# EAGLE design photon (EAGLE 7.1.0)

## Sheet 1 of 2
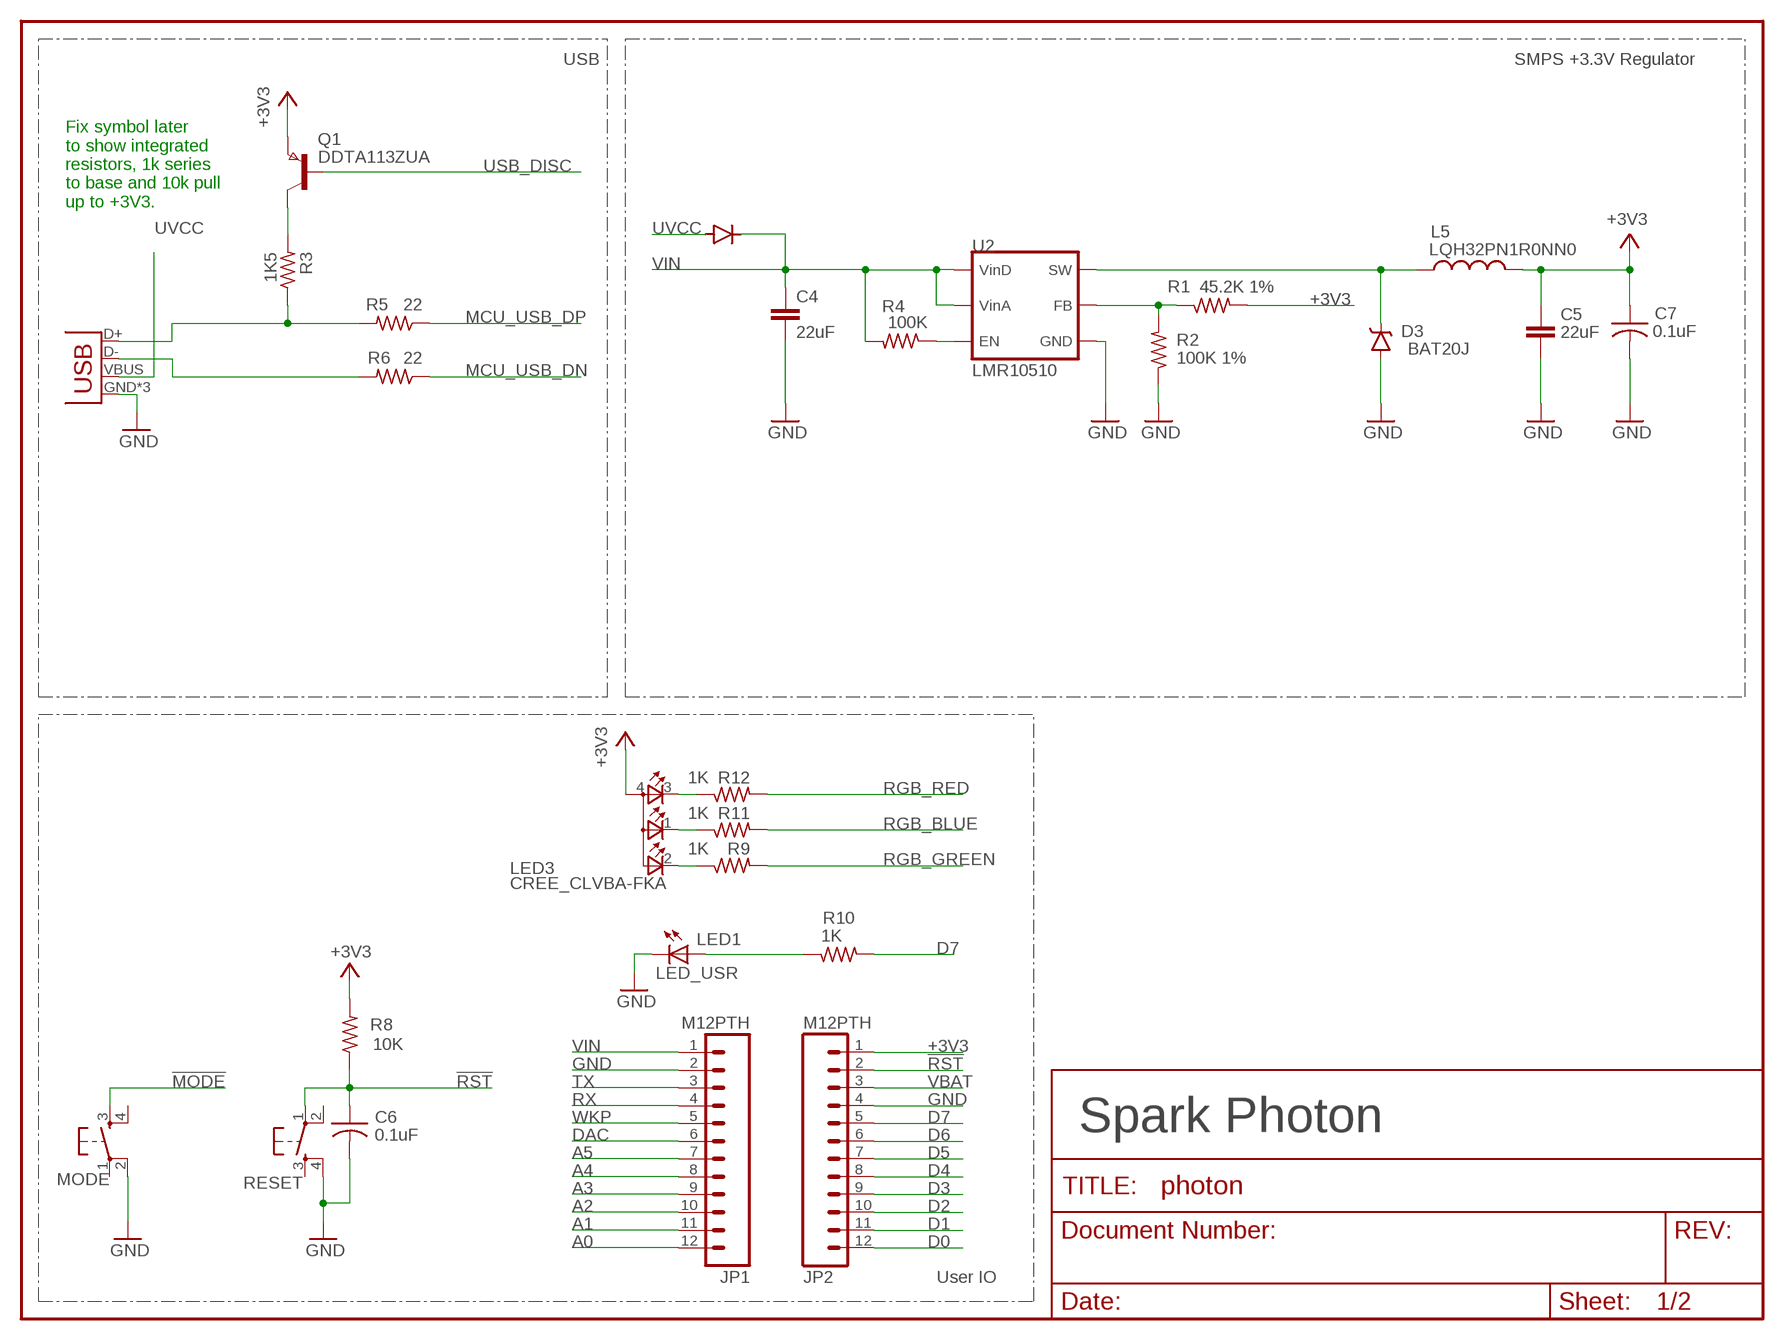
[diagram p0: schematic, sheet 1]

### Parts
C4  22uF  C-EUC0603  [C0603]
C5  22uF  C-EUC0603  [C0603]
C6  0.1uF  C-USC0402  [C0402]
C7  0.1uF  C-USC0402  [C0402]
D1  DIODE  [DIODE-DO-220AA(SMP)]
D3  BAT20J  DIODE-SCHOTTKY-BAT20J  [SOD-323]
JP1  M12PTH  [1X12-SMALL-PADS]
JP2  M12PTH  [1X12-SMALL-PADS]
L5  LQH32PN1R0NN0  INDUCTOR-SPARKFUN1210  [1210]
LED3  CREE_CLVBA-FKA  TOPLED-3CREE_CLVBA-FKA  [P-LCC-4-3]
LED_USR  LED0603  [LED-0603]
MODE  KMR211GLFS  TAC_SWITCHSMD  [TACTILE_SWITCH_SMD]
Q1  DDTA113ZUA  PNPSOT323  [SOT323]
R1  45.2K 1%  R-US_R0402  [R0402]
R2  100K 1%  R-US_R0402  [R0402]
R3  1K5  R-US_R0402  [R0402]
R4  100K  R-US_R0402  [R0402]
R5  22  R-US_R0402  [R0402]
R6  22  R-US_R0402  [R0402]
R8  10K  R-US_R0402  [R0402]
R9  1K  R-US_R0402  [R0402]
R10  1K  R-US_R0402  [R0402]
R11  1K  R-US_R0402  [R0402]
R12  1K  R-US_R0402  [R0402]
RESET  KMR211GLFS  TAC_SWITCHSMD  [TACTILE_SWITCH_SMD]
U2  LMR10510  [WSON-6-PAD]
X1  USB-MICROB  USBUSB-MICROB-SLOT-HOLE  [USB-MICROB-SLOT-HOLE]

### Nets
!MODE: MODE.3 ; also sheet 2
!RST: C6.1 JP2.2 R8.1 RESET.1 ; also sheet 2
+3V3: C5.1 C7.1 JP2.1 L5.2 LED3.4(A2) Q1.3(E) R1.2 R8.2
A0: JP1.12 ; also sheet 2
A1: JP1.11 ; also sheet 2
A2: JP1.10 ; also sheet 2
A3: JP1.9 ; also sheet 2
A4: JP1.8 ; also sheet 2
A5: JP1.7 ; also sheet 2
D0: JP2.12 ; also sheet 2
D1: JP2.11 ; also sheet 2
D2: JP2.10 ; also sheet 2
D3: JP2.9 ; also sheet 2
D4: JP2.8 ; also sheet 2
D5: JP2.7 ; also sheet 2
D6: JP2.6 ; also sheet 2
D7: JP2.5 R10.2
DAC: JP1.6 ; also sheet 2
EN: R4.1 U2.6(EN)
FB: R1.1 R2.2 U2.1(FB)
GND [vcc]: C4.2 C5.2 C6.2 C7.2 D3.A JP1.2 JP2.4 LED_USR.C MODE.2 R2.1 RESET.4 U2.2(GND) U2.PAD(GND) X1.GND X1.MT1(GND) X1.MT2(GND) ; also sheet 2
LED1: LED_USR.A R10.1
MCU_USB_DN: R6.1 ; also sheet 2
MCU_USB_DP: R5.1 ; also sheet 2
N$1: R3.1 R5.2 X1.D+
N$6: R6.2 X1.D-
N$9: Q1.1(C) R3.2
N$27: LED3.1(CBLUE) R11.1
N$29: LED3.2(CGREEN) R9.1
N$54: LED3.3(CRED) R12.1
RGB_BLUE: R11.2 ; also sheet 2
RGB_GREEN [vcc]: R9.2 ; also sheet 2
RGB_RED: R12.2 ; also sheet 2
RX: JP1.4 ; also sheet 2
SW: D3.C L5.1 U2.3(SW)
TX: JP1.3 ; also sheet 2
USB_DISC: Q1.2(B) ; also sheet 2
UVCC: D1.ANODE X1.VBUS
VBAT: JP2.3 ; also sheet 2
VIN [vcc]: C4.1 D1.CATHODE JP1.1 R4.2 U2.4(VIND) U2.5(VINA)
WKP: JP1.5 ; also sheet 2
Unconnected: MODE.1 MODE.4 RESET.2 RESET.3

### Notes on the sheet
- USB | SMPS +3.3V Regulator
- Fix symbol later 
  to show integrated 
  resistors, 1k series 
  to base and 10k pull 
  up to +3V3.
- Spark Photon
- User IO

## Sheet 2 of 2
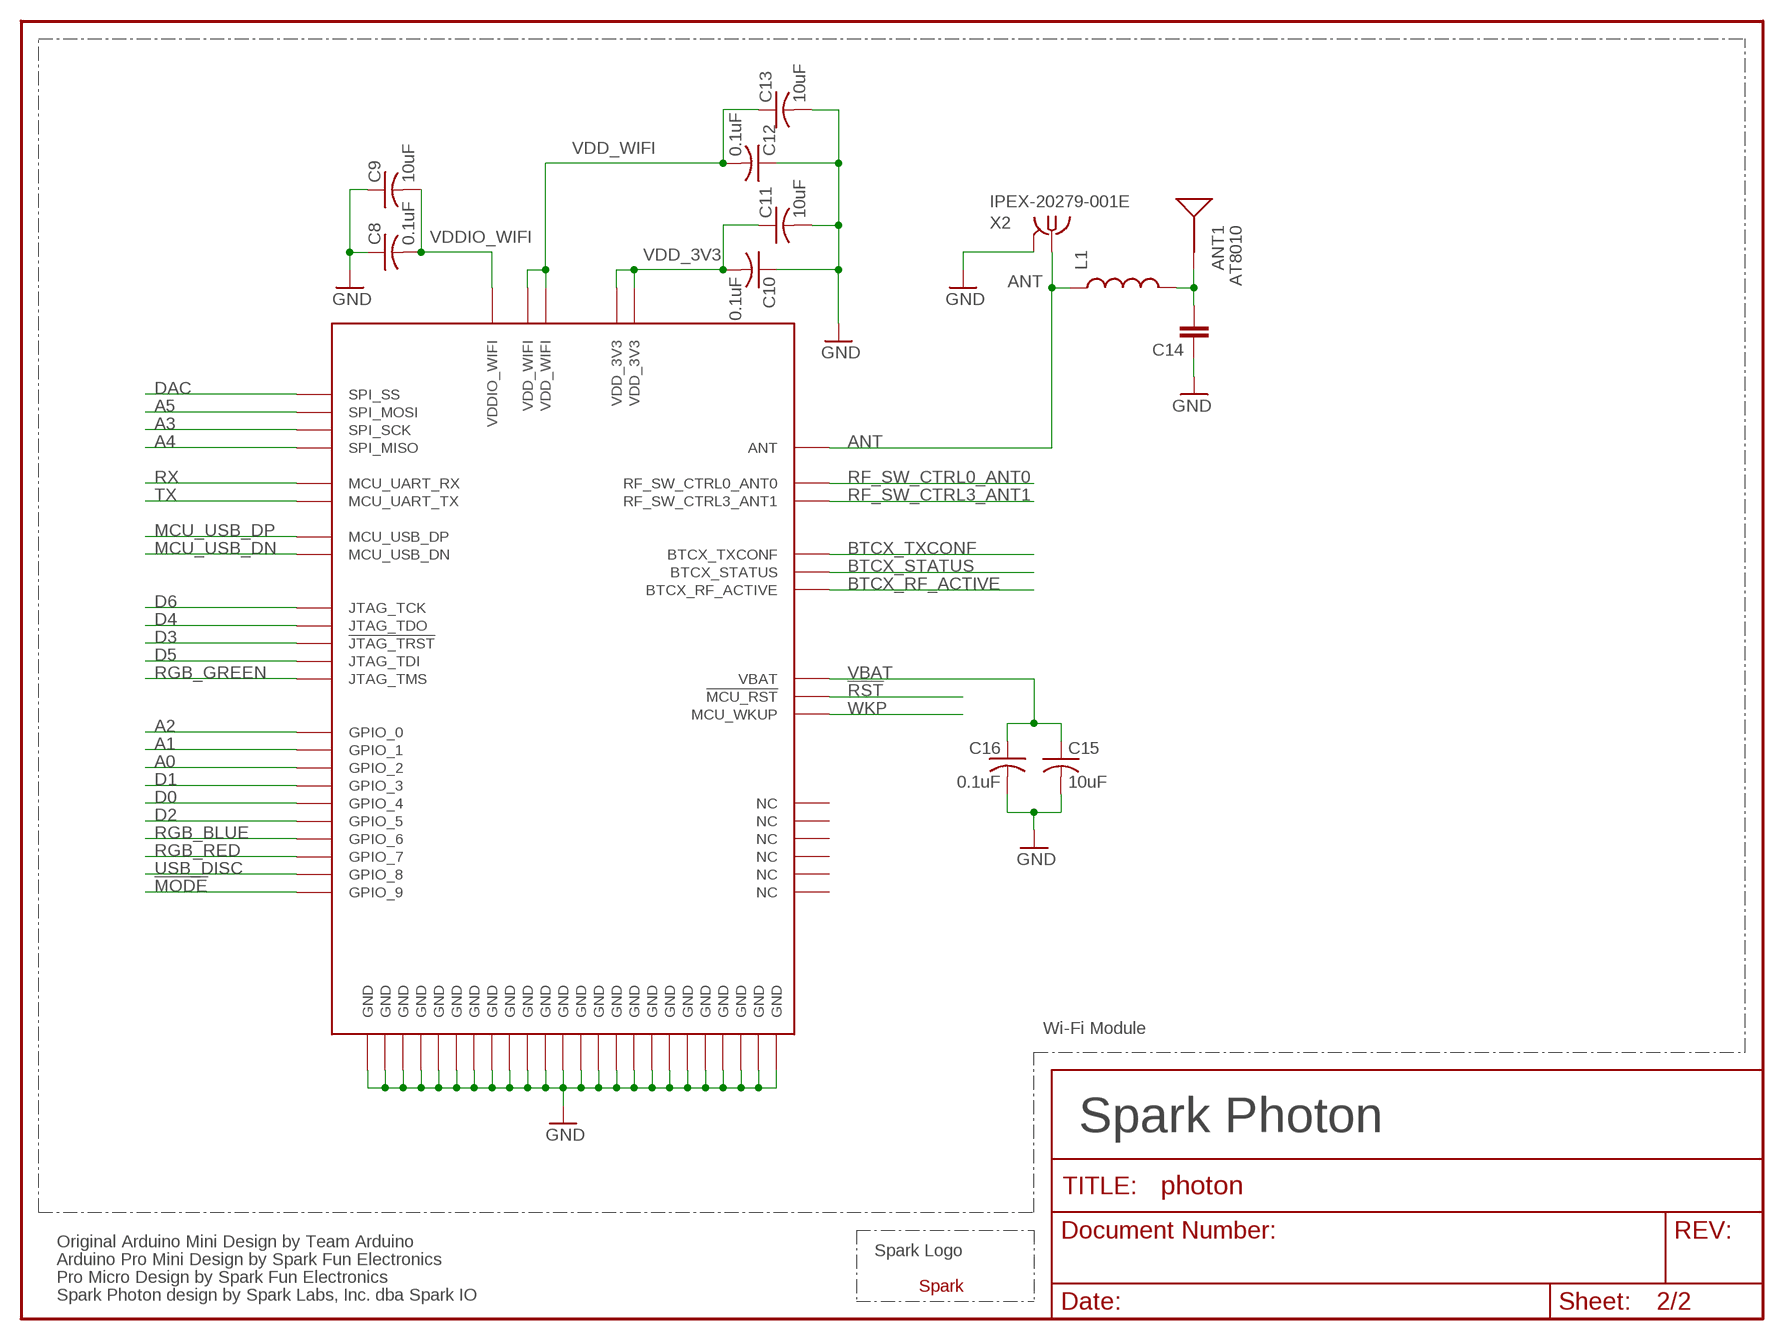
[diagram p1: schematic, sheet 2]

### Parts
ANT1  AT8010  [AT8010]
C8  0.1uF  C-USC0402  [C0402]
C9  10uF  C-USC0402  [C0402]
C10  0.1uF  C-USC0402  [C0402]
C11  10uF  C-USC0402  [C0402]
C12  0.1uF  C-USC0402  [C0402]
C13  10uF  C-USC0402  [C0402]
C14  CAP0603-CAP  [0603-CAP]
C15  10uF  C-USC0402  [C0402]
C16  0.1uF  C-USC0402  [C0402]
L1  INDUCTOR-SPARKFUN0603  [0603]
U1  WM-N-BM-09  [WM-N-BM-09]
U$2  SPARK_LOGO2  [SPARK_LOGO2]
X2  IPEX-20279-001E  [IPEX-20279-001E]

### Nets
!MODE: U1.P$53(GPIO_9) ; also sheet 1
!RST: U1.P$26(!MCU_RST) ; also sheet 1
A0: U1.P$6(GPIO_2) ; also sheet 1
A1: U1.P$7(GPIO_1) ; also sheet 1
A2: U1.P$8(GPIO_0) ; also sheet 1
A3: U1.P$24(SPI_SCK) ; also sheet 1
A4: U1.P$25(SPI_MISO) ; also sheet 1
A5: U1.P$23(SPI_MOSI) ; also sheet 1
ANT [RF]: L1.1 U1.P$15(ANT) X2.1
BTCX_RF_ACTIVE: U1.P$9(BTCX_RF_ACTIVE)
BTCX_STATUS: U1.P$10(BTCX_STATUS)
BTCX_TXCONF: U1.P$11(BTCX_TXCONF)
D0: U1.P$4(GPIO_4) ; also sheet 1
D1: U1.P$5(GPIO_3) ; also sheet 1
D2: U1.P$3(GPIO_5) ; also sheet 1
D3: U1.P$42(!JTAG_TRST) ; also sheet 1
D4: U1.P$41(JTAG_TDO) ; also sheet 1
D5: U1.P$43(JTAG_TDI) ; also sheet 1
D6: U1.P$40(JTAG_TCK) ; also sheet 1
DAC: U1.P$22(SPI_SS) ; also sheet 1
GND [vcc]: C8.1 C9.1 C10.1 C11.2 C12.1 C13.2 C14.1 C15.2 C16.2 U1.P$14(GND) U1.P$16(GND) U1.P$17(GND) U1.P$18(GND) U1.P$21(GND) U1.P$29(GND) U1.P$30(GND) U1.P$37(GND) U1.P$45(GND) U1.P$48(GND) U1.P$50(GND) U1.P$55(GND) U1.P$56(GND) U1.P$57(GND) U1.P$58(GND) U1.P$59(GND) U1.P$60(GND) U1.P$61(GND) U1.P$62(GND) U1.P$63(GND) U1.P$64(GND) U1.P$65(GND) U1.P$66(GND) U1.P$67(GND) X2.2@1(GND) X2.2@2(GND) ; also sheet 1
MCU_USB_DN: U1.P$52(MCU_USB_DN) ; also sheet 1
MCU_USB_DP: U1.P$51(MCU_USB_DP) ; also sheet 1
N$2 [RF]: ANT1.SIG(SIGNAL) C14.2 L1.2
RF_SW_CTRL0_ANT0: U1.P$13(RF_SW_CTRL0_ANT0)
RF_SW_CTRL3_ANT1: U1.P$12(RF_SW_CTRL3_ANT1)
RGB_BLUE: U1.P$2(GPIO_6) ; also sheet 1
RGB_GREEN [vcc]: U1.P$44(JTAG_TMS) ; also sheet 1
RGB_RED: U1.P$1(GPIO_7) ; also sheet 1
RX: U1.P$38(MCU_UART_RX) ; also sheet 1
TX: U1.P$39(MCU_UART_TX) ; also sheet 1
USB_DISC: U1.P$54(GPIO_8) ; also sheet 1
VBAT: C15.1 C16.1 U1.P$28(VBAT) ; also sheet 1
VDD_3V3: C10.2 C11.1 U1.P$46(VDD_3V3) U1.P$47(VDD_3V3)
VDD_WIFI: C12.2 C13.1 U1.P$19(VDD_WIFI) U1.P$20(VDD_WIFI)
VDDIO_WIFI: C8.2 C9.2 U1.P$49(VDDIO_WIFI)
WKP: U1.P$27(MCU_WKUP) ; also sheet 1
Unconnected: U1.P$31(NC) U1.P$32(NC) U1.P$33(NC) U1.P$34(NC) U1.P$35(NC) U1.P$36(NC)

### Notes on the sheet
- Wi-Fi Module
- Spark Photon
- Original Arduino Mini Design by Team Arduino
- Spark Logo
- Arduino Pro Mini Design by Spark Fun Electronics
- Pro Micro Design by Spark Fun Electronics
- Spark Photon design by Spark Labs, Inc. dba Spark IO

## Library data of the parts
ANT1 = Spark:AT8010: AT8010 Series Multilayer Chip Antenna
C4 C5 = rcl:C-EU: CAPACITOR, European symbol
C6-C13 C15 C16 = adafruit:C-US: CAPACITOR, American symbol
C14 = SparkFun-Capacitors:CAP: Capacitor Standard 0603 ceramic capacitor, and 0.1" leaded capacitor.
D1 = Spark:DIODE
D3 = SparkFun-DiscreteSemi:DIODE-SCHOTTKY: Schottky diodes in SFE's production catalog BAT20J 1A 23V 0.62Vf RB751 120mA 40V 0.37Vf PMEG4005EJ 0.5A 40V 0.42Vf MBRA140 1A 40V 0.5Vf B340A 3A 40V SMA; PROD_ID: DIO-11623
JP1 JP2 = Spark:M12: Header 12 Standard 12-pin 0.1" header. Use with straight break away headers (SKU : PRT-00116), right angle break away headers (PRT-00553), swiss pins (PRT-00743), machine pins (PRT-00117), and female headers (PRT-00115).
L1 L5 = Spark:INDUCTOR-SPARKFUN: Inductors Basic Inductor/Choke - 0603 and 1206. Footprints are not proven and vary greatly between part numbers. SRN6045- 33uH, 20% 1.4A
LED3 = Spark:TOPLED-3: Cree CLVBA-FKA
LED_USR = SparkFun:LED: LEDs Standard schematic elements and footprints for 5mm, 3mm, 1206, and 0603 sized LEDs. 5mm - Spark Fun Electronics SKU : COM-00529 (and others)
MODE RESET = Spark:TAC_SWITCH: SMD Tactiile Switch
Q1 = zetex:PNPSOT323: PNP TRANSISTOR; MPN: 2DB1689-7; OC_FARNELL: 1710698; OC_NEWARK: 25R5667
R1 R2 R4 R8-R12 = adafruit:R-US_: RESISTOR, American symbol
R3 R5 R6 = rcl:R-US_: RESISTOR, American symbol
U1 = Spark:WM-N-BM-09
U2 = Spark:LMR10510
U$2 = Spark:SPARK_LOGO2
X1 = Spark:USB
X2 = Spark:IPEX-20279-001E: Ultra Miniature Coaxial SMT RF Receptacle

## Net classes
2 RF: width 0.381 mm, clearance 0.381 mm

## Board
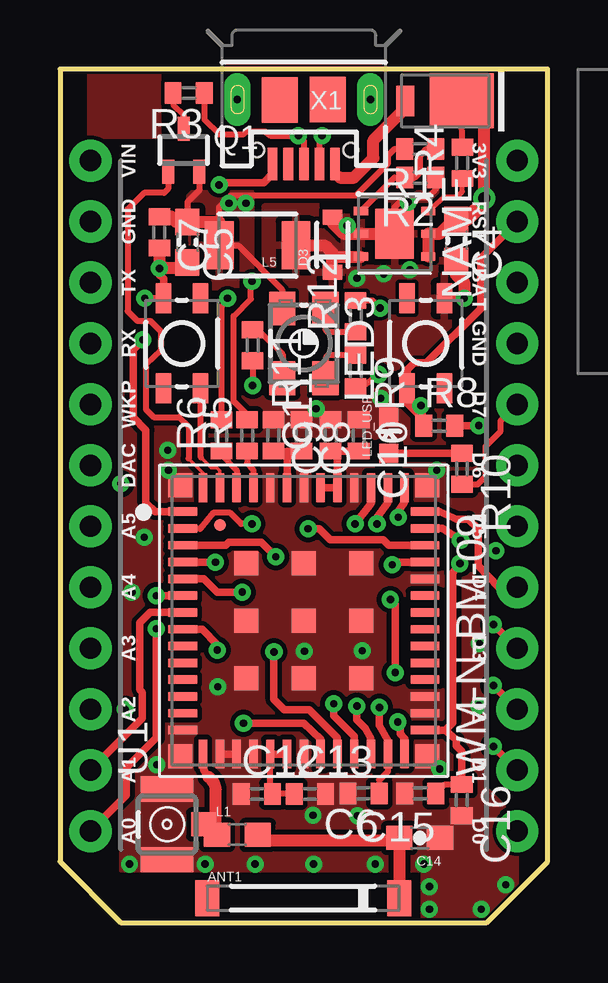
[diagram p2: board, top side]
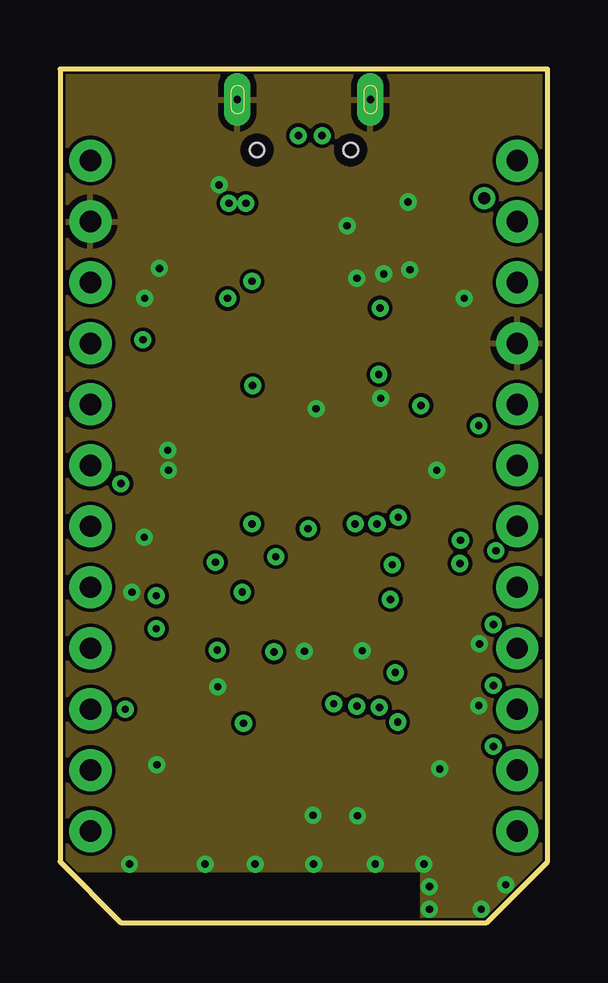
[diagram p3: board, inner layer $GND]
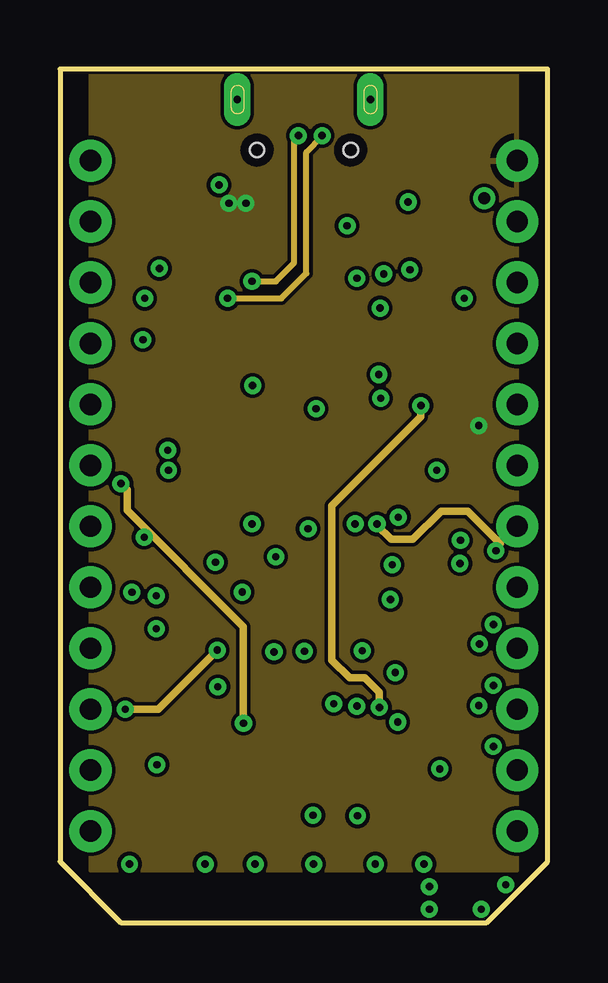
[diagram p4: board, inner layer $+3V3]
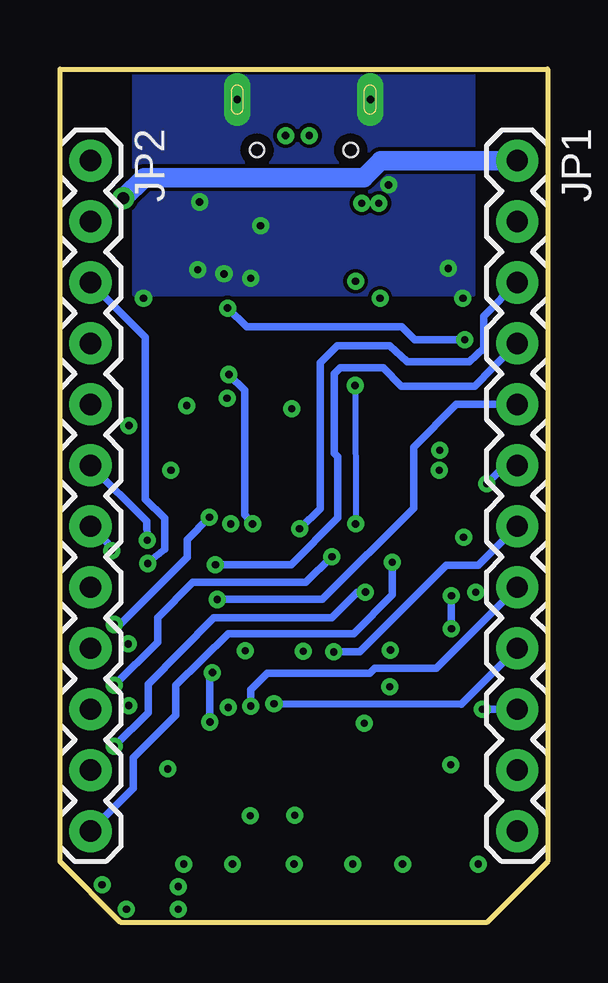
[diagram p5: board, bottom side, seen from below]

Size 20.32 x 35.56 mm. Coordinates in mm from the lower left corner, seen from the top.
Outline: 0,35.56 0,2.54 2.54,0 17.78,0 20.32,2.54 20.32,35.56 0,35.56
Copper layers (1+2*15+16): Top 0.035mm / dielectric 1.5mm / $GND 0.035mm / dielectric 0.15mm / $+3V3 0.035mm / dielectric 0.2mm / Bottom 0.035mm
Design rules "spark *": minimum track width 6mil, minimum drill 0.3mm, track to track 6mil, track to pad 6mil, pad to pad 6mil, via to via 6mil, smd to smd 6mil, copper to edge 4mil, drill to drill 6mil, minimum pad ring 12mil, minimum via ring 8mil, stop-mask expansion 4mil, vias tented up to drill 20mil, thermal gap 10mil

### Footprints (pad centres in the part's own frame; a part is rotated, then mirrored left to right if it is on the bottom)
AT8010 = smd 1 x 1.5: NC -4,0; SIG 4,0
C0603 = smd 1.1 x 1: 1 -0.85,0; 2 0.85,0
C0402 = smd 0.7 x 0.9: 1 -0.65,0; 2 0.65,0
0603-CAP = smd 1.1 x 1: 1 -0.85,0; 2 0.85,0
DIODE-DO-220AA(SMP) = smd 0.762 x 1.27: ANODE 2.349,0 | smd 2.667 x 2.286: CATHODE 0,0
SOD-323 = smd 0.63 x 0.83: A 1.15,0; C -1.15,0
1X12-SMALL-PADS = drill 0.889 pad 1.753: 1 0,0; 2 2.54,0; 3 5.08,0; 4 7.62,0; 5 10.16,0; 6 12.7,0; 7 15.24,0; 8 17.78,0; 9 20.32,0; 10 22.86,0; 11 25.4,0; 12 27.94,0
0603 = smd 1.1 x 1: 1 -0.85,0; 2 0.85,0
1210 = smd 1.2 x 2: 1 -1.6,0; 2 1.6,0
P-LCC-4-3 = smd 1.1 x 1.4: 1 -0.9,-1.45; 2 0.9,-1.45; 3 0.9,1.45; 4 -0.9,1.45
LED-0603 = smd 0.8 x 0.8: A 0,-0.75; C 0,0.75
TACTILE_SWITCH_SMD = smd 1.25 x 0.65: 1 -1.875,0.775; 2 1.875,0.775; 3 -1.875,-0.775; 4 1.875,-0.775
SOT323 = smd 0.5 x 1: 1 0,0.9; 2 -0.65,-0.9; 3 0.65,-0.9
R0402 = smd 0.7 x 0.9: 1 -0.65,0; 2 0.65,0
WM-N-BM-09 = smd 0.35 x 1.2: P$1 4.55,5.05; P$2 3.85,5.05; P$3 3.15,5.05; P$4 2.45,5.05; P$5 1.75,5.05; P$6 1.05,5.05; P$7 0.35,5.05; P$8 -0.35,5.05; P$9 -1.05,5.05; P$10 -1.75,5.05; P$11 -2.45,5.05; P$12 -3.15,5.05; P$13 -3.85,5.05; P$14 -4.55,5.05; P$28 -4.55,-5.05; P$29 -3.85,-5.05; P$30 -3.15,-5.05; P$31 -2.45,-5.05; P$32 -1.75,-5.05; P$33 -1.05,-5.05; P$34 -0.35,-5.05; P$35 0.35,-5.05; P$36 1.05,-5.05; P$37 1.75,-5.05; P$38 2.45,-5.05; P$39 3.15,-5.05; P$40 3.85,-5.05; P$41 4.55,-5.05 | smd 1.2 x 0.35: P$15 -5.55,4.2; P$16 -5.55,3.5; P$17 -5.55,2.8; P$18 -5.55,2.1; P$19 -5.55,1.4; P$20 -5.55,0.7; P$21 -5.55,0; P$22 -5.55,-0.7; P$23 -5.55,-1.4; P$24 -5.55,-2.1; P$25 -5.55,-2.8; P$26 -5.55,-3.5; P$27 -5.55,-4.2; P$42 5.55,-4.2; P$43 5.55,-3.5; P$44 5.55,-2.8; P$45 5.55,-2.1; P$46 5.55,-1.4; P$47 5.55,-0.7; P$48 5.55,0; P$49 5.55,0.7; P$50 5.55,1.4; P$51 5.55,2.1; P$52 5.55,2.8; P$53 5.55,3.5; P$54 5.55,4.2 | smd 1 x 1: P$55 5.65,5.15; P$56 -5.65,5.15; P$57 -5.65,-5.15; P$58 5.65,-5.15; P$59 2.4,2.4; P$60 0,2.4; P$61 -2.4,2.4; P$62 2.4,0; P$63 0,0; P$64 -2.4,0; P$65 2.4,-2.4; P$66 0,-2.4; P$67 -2.4,-2.4 | smd 0.5 x 0.5: P$68 4,3.5
WSON-6-PAD = smd 0.35 x 0.6: 1 -0.95,-1.4; 2 0,-1.4; 3 0.95,-1.4; 4 0.95,1.4; 5 0,1.4; 6 -0.95,1.4 | smd 2.1 x 1.6: PAD 0,0
USB-MICROB-SLOT-HOLE = smd 0.4 x 1.35: D+ 0,2.675; D- -0.65,2.675; GND 1.3,2.675; ID 0.65,2.675; VBUS -1.3,2.675 | drill 0.3 pad 1.1 long: MT1 -2.775,0; MT2 2.775,0 | smd 1.5 x 1.9: P$1 -1,0; P$2 1,0.01 | hole 0.6: -1.95,2.1; 1.95,2.1
IPEX-20279-001E = smd 1 x 1.05: 1 0,1.528 | smd 1.05 x 2.2: 2@1 -1.475,0; 2@2 1.475,0

### Placement (x,y rotation side)
ANT1  10.13,1.02 0 top
C4  16.51,28.42 270 top
C5  5.31,28.35 270 top
C6  12.65,5.38 180 top
C7  4.14,28.75 270 top
C8  10.06,20.29 270 top
C9  8.89,20.29 270 top
C10  12.45,20.29 270 top
C11  11.28,20.29 90 top
C12  8.2,5.36 0 top
C13  10.41,5.36 0 top
C14  14.99,3.53 180 top
C15  15.01,5.38 180 top
C16  16.74,5.11 270 top
D1  16.74,34.24 180 top
D3  11.35,28.24 90 top
JP1  1.27,31.75 270 bottom
JP2  19.05,31.75 270 bottom
L1  7.39,3.66 0 top
L5  8.23,28.22 180 top
LED3  10.16,24.13 0 top
LED_USR  13.7,20.3 0 top
MODE  5.08,24.13 90 top
Q1  5.16,32.18 0 top
R1  15.01,32.23 180 top
R2  15.01,31.04 180 top
R3  5.36,34.57 180 top
R4  16.76,31.65 90 top
R5  7.8,20.29 90 top
R6  6.73,20.29 90 top
R8  15.8,20.7 0 top
R9  12.32,22.99 270 top
R10  16.75,18.91 270 top
R11  8.03,24.05 270 top
R12  12.32,25.27 90 top
RESET  15.24,24.13 90 top
U1  10.16,12.57 90 top
U2  13.94,28.7 270 top
U$2  1.55,32.87 0 top
X1  10.16,34.29 180 top
X2  4.46,4.09 270 top

### Tracks (layer width: path | path; a pad name or v marks a point on that pad's centre or on a via)
!MODE
  Top 0.152: U1.P$53 6.66,18.82 6.53,18.95 6.3,18.95 5.87,19.38
  Top 0.254: 5.87,19.38 MODE.3
!RST  (via drill 0.3)
  Top 0.254: U1.P$26 13.66,6.29 13.3,5.93 C6.1 | 15.14,20.98 15.14,21.44 v15.04,21.54
  Top 0.305: R8.1 15.14,20.98 14.48,21.64 14.48,22.24 RESET.1 14.46,23.02 14.76,23.32 15.27,23.32 17.53,25.58 17.53,27.69 JP2.2 | U1.P$26 13.66,7.6 13.31,8.23 v13.31,8.97
  $+3V3 0.305: v15.04,21.54 15.04,21.08 11.33,17.37 11.33,10.92 12.06,10.21 12.7,10.21 13.31,9.6 v13.31,8.97
+3V3  (via drill 0.3)
  Top 0.254: R1.2 13.95,32.23 13.66,31.95 13.66,31.62 12.34,30.3 7.14,30.3 6.63,29.79 6.63,29.21 L5.2 7.42,28.22 9.26,26.38 LED3.4 | C7.1 4.15,29.41 | Q1.3 5.81,30.52 5.31,30.02 C5.1
  Top 0.305: R8.2 17.1,20.7 v17.45,20.71
  Top 0.508: 4.15,29.41 4.62,29.41 4.84,29.2 C5.1 5.32,29.21 6.63,29.21
  other vias: 7.04,29.97 7.75,29.97
  pour $+3V3: 1.27,35.56 19.05,35.56 19.05,2.16 1.27,2.16
  pour Top: 7.95,26.97 8.03,26.67 8.1,26.49 5.59,26.49 5.41,30.25 5.59,30.43 7.95,30.4
A0  (via drill 0.3)
  Top 0.305: U1.P$6 4.02,13.62 v4.01,13.61 | v4.01,12.24 4.01,7.7 2.77,6.45 2.77,5.31 JP1.12
  Bottom 0.305: v4.01,13.61 v4.01,12.24
A1
  Top 0.305: U1.P$7 3.75,12.92 3.33,12.5 3.33,9.73 3.43,9.58 3.43,8.51 JP1.11
A2  (via drill 0.3)
  Top 0.305: U1.P$8 5.92,12.22 6.55,11.58 v6.55,11.35
  $+3V3 0.305: v6.55,11.35 4.09,8.89 v2.72,8.89
  Bottom 0.305: v2.72,8.89 JP1.10
A3  (via drill 0.3)
  Top 0.305: U1.P$24 12.26,7.75 11.4,8.61 v11.4,9.12
  Bottom 0.305: JP1.9 3.61,9.09 v11.4,9.12
A4  (via drill 0.3)
  Top 0.305: U1.P$25 12.96,7.49 12.95,7.64 12.93,7.72 12.72,8.1 12.37,8.46 v12.37,9.02
  Bottom 0.305: JP1.8 4.65,10.59 7.21,10.59 7.42,10.39 11.68,10.39 12.37,9.7 v12.37,9.02
A5  (via drill 0.3)
  Top 0.305: v8.91,11.28 8.91,9.3 9.35,8.87 10.39,8.87 11.56,7.69 U1.P$23
  Bottom 0.305: v8.91,11.28 7.82,11.28 4.22,14.88 2.9,14.88 JP1.7
ANT
  Top 0.254: 6.48,3.99 6.43,3.73 L1.1
  Top 0.305: L1.1 X2.1 | U1.P$15 5.96,6.64 arc54 6.2,6.07
  Top 0.508: 6.48,3.99 6.48,5.41 arc57 6.2,6.07
D0  (via drill 0.3)
  Top 0.305: U1.P$4 6.46,15.02 v6.48,15.01
  Bottom 0.305: v6.48,15.01 6.48,13.66 8.08,12.04 13.31,12.04 15.49,9.88 15.49,8.64 17.27,6.86 17.27,5.59 JP2.12
D1  (via drill 0.3)
  Top 0.305: JP2.11 v18.06,7.34 | v7.59,13.77 6.55,13.77 5.99,14.33 U1.P$5
  Bottom 0.305: v7.59,13.77 7.92,13.77 8.99,12.7 13.92,12.7 16.64,9.93 16.64,8.74 v18.06,7.34
D2  (via drill 0.3)
  Top 0.305: JP2.10 v18.06,9.88 | v8.99,15.24 8.38,15.85 7.04,15.85 6.91,15.72 U1.P$3 | U1.P$3
  Bottom 0.305: v18.06,9.88 16.26,11.68 16.26,12.7 14.78,14.17 10.08,14.17 v8.99,15.24
D3  (via drill 0.3)
  Top 0.305: 14.33,18.09 U1.P$42 14.35,17.53 14.35,17.5 14.1,17.14 v14.1,16.89 | v18.06,12.42 JP2.9
  Bottom 0.305: v14.1,16.89 15.01,15.95 15.01,15.21 17.8,12.42 v18.06,12.42
D4
  Top 0.305: U1.P$41 15.82,17.12 16.54,16.82 17.02,16.82 17.42,16.41 17.42,14.86 18.29,13.97 JP2.8
D5  (via drill 0.3)
  Top 0.305: U1.P$43 13.66,17.53 13.66,17.5 13.21,16.87 v13.21,16.61
  $+3V3 0.305: v13.21,16.61 13.21,16.56 13.79,15.98 14.71,15.98 15.88,17.14 16.99,17.14 18.34,15.77 v18.16,15.49
  Bottom 0.305: v18.16,15.49 18.34,15.8 JP2.7
D6  (via drill 0.3)
  Top 0.305: U1.P$40 15.94,16.42 v16.69,15.93
  Bottom 0.305: v16.69,15.93 16.71,16.71 JP2.6
D7
  Top 0.254: R10.2 17.4,18.26 17.73,18.59 17.73,19.84 18.36,20.47 18.36,20.9 JP2.5
DAC  (via drill 0.3)
  Top 0.305: U1.P$22 10.86,7.63 10.16,8.31 v7.64,8.31
  $+3V3 0.305: v7.64,8.31 7.64,12.32 2.79,17.17 2.79,18.03 v2.54,18.29
  Bottom 0.305: v2.54,18.29 1.78,19.05 JP1.6
EN
  Top 0.203: U2.6 16,30.25 16.56,30.25 16.76,30.45 R4.1
FB
  Top 0.254: R1.1 15.27,32.23 15.01,31.95 15.01,31.27 14.78,31.04 R2.2 13.93,31.04 U2.1
GND  (via drill 0.3)
  Top 0.254: R2.1 15.67,31.03 15.67,30.58 15.29,30.2 14.35,30.2 13.95,29.79 U2.PAD | v16.84,26.01 RESET.4 | C5.2 5.07,27.25 | MODE.2 v3.53,26.01
  Top 0.305: U1.P$16 U1.P$17 | v4.14,27.25 4.14,27 4.32,26.82 4.32,26.02 MODE.2 | X1.GND 8.86,31.21 8.48,30.84 6.73,30.84 v6.63,30.73
  Top 0.508: U2.PAD U2.2 11.81,28.7 11.35,29.16 D3.A | C4.2 16.51,27 16.84,26.67 v16.84,26.01 | 5.07,27.25 v4.14,27.25 C7.2
  other vias: 15.39,0.56 8.13,2.44 13.13,2.44 15.16,2.44 15.82,6.4 10.57,2.44 2.9,2.44 15.39,1.5 18.57,1.57 17.55,0.56 6.05,2.44 10.54,4.47 12.4,4.45 4.04,6.58 13.36,21.84 10.67,21.41 12.37,26.85 13.49,27.03 14.58,27.2 14.5,30.02 11.96,29.03 15.7,18.85 4.52,18.85 10.19,11.3 12.6,11.33 4.5,19.68 6.58,9.83 3.51,16.05 3,13.77 17.48,11.61 17.45,9.04
  pour $GND: 0,35.56 20.32,35.56 20.45,3.05 20.45,2.67 17.78,0 15.11,0 15.11,2.18 0.48,2.18 0.13,2.54 0.13,3.05
  pour Top (isolate 0.203, no thermals): 2.54,2.16 2.54,22.3 17.78,22.3 17.78,5.59 18.8,4.57 18.8,2.16
  pour Bottom (no thermals): 3.08,35.56 17.24,35.56 17.24,26.16 3.08,26.16
  pour Top (no thermals): 15.09,4.57 15.09,0 17.78,0 19.05,1.27 19.05,4.57
  pour Top: 16.13,29.69 16.18,29.64 16.18,23.22 16.1,23.14 13.67,23.14 13.23,23.57 13.23,26.14 13.16,26.21 13.16,26.19 11.84,26.19 11.84,30.23 13.16,30.23 13.34,30.4 16,30.4 16.13,30.28
GOLDIFY
  pour Top (no thermals): 1.27,35.56 4.09,35.56 4.09,32.77 1.27,32.77
LED1
  Top 0.305: LED_USR.A 16.1,19.55 R10.1
MCU_USB_DN
  Top 0.254: R6.1 6.73,19.48 7.36,18.85 U1.P$52
MCU_USB_DP
  Top 0.254: U1.P$51 8.05,18.87 7.8,19.15 R5.1
N$1  (via drill 0.3)
  Top 0.254: R5.2 7.8,21.16 7.24,21.72 7.24,25.27 7.95,25.98 7.95,26.67 v8,26.72 | X1.D+ 10.16,32.56 v9.93,32.79 8.76,32.79 8.53,32.97 7.8,32.97 7.62,32.84 6.63,32.84 6.02,33.45 6.02,34.38 R3.1
  $+3V3 0.254: v8,26.72 8.99,26.72 9.75,27.48 9.75,32.61 v9.93,32.79
N$2
  Top 0.508: L1.2 arc48 8.38,3.43 13.97,3.43 C14.2 ANT1.SIG
  Top 0.61: ANT1.SIG
N$4
  cutout $GND: 7.52,32.19 arc-90 8.21,32.88 8.22,32.88 arc-91 8.9,32.19 arc-88 8.21,31.5 arc-92
N$6  (via drill 0.3)
  Top 0.254: R6.2 6.73,25.65 v6.99,26.01 | 10.82,31.62 X1.D- 10.81,32.68 v10.92,32.79
  $+3V3 0.254: v6.99,26.01 9.22,26.01 10.26,27.05 10.26,32.11 v10.92,32.79
N$9
  Top 0.254: R3.2 4.72,34.55 4.72,34.06 5.16,33.63 Q1.1
N$17
  cutout $GND: 11.42,32.19 arc-90 12.11,32.88 12.12,32.88 arc-91 12.8,32.19 arc-88 12.11,31.5 arc-92
N$18
  cutout $+3V3: 7.52,32.19 arc-90 8.21,32.88 8.22,32.88 arc-91 8.9,32.19 arc-88 8.21,31.5 arc-92
N$19
  cutout $+3V3: 11.42,32.19 arc-90 12.11,32.88 12.12,32.88 arc-91 12.8,32.19 arc-88 12.11,31.5 arc-92
N$20
  cutout Bottom: 7.52,32.19 arc-90 8.21,32.88 8.22,32.88 arc-91 8.9,32.19 arc-88 8.21,31.5 arc-92
N$21
  cutout Bottom: 11.42,32.19 arc-90 12.11,32.88 12.12,32.88 arc-91 12.8,32.19 arc-88 12.11,31.5 arc-92
N$22
  cutout $+3V3: 6.77,33.72 6.77,34.87 arc-90 7.43,35.41 7.44,35.41 arc-90 8,34.85 8,33.76 arc-90 7.47,33.17 arc-90
  cutout $+3V3: 12.32,33.72 12.32,34.85 arc-90 12.88,35.41 12.89,35.41 arc-90 13.55,34.82 13.55,33.76 arc-90 12.81,33.17 arc-90
N$27
  Top 0.254: R11.1 8.39,24.55 9.27,23.67 9.27,22.69 LED3.1
N$29
  Top 0.254: R9.1 11.17,23.64 11.07,23.55 11.07,22.69 LED3.2
N$54
  Top 0.254: LED3.3 11.06,24.7 11.15,24.61 12.31,24.61 R12.1
RGB_BLUE  (via drill 0.3)
  Top 0.254: R11.2 v8.03,22.38 | 5.12,16.43 U1.P$2 5.12,16.41 5.84,16.41 6.38,17.07 7.09,17.07 7.54,16.61 v8,16.61
  Bottom 0.254: v8.03,22.38 v8,16.61
RGB_GREEN  (via drill 0.3)
  Top 0.254: R9.2 12.61,22.34 v13.28,22.84
  Top 0.305: U1.P$44 12.96,17.48 v12.29,16.61
  Bottom 0.305: v12.29,16.61 12.62,16.99 12.62,22.17 v13.28,22.84
RGB_RED  (via drill 0.3)
  Top 0.254: R12.2 13.02,25.92 v13.34,25.6
  Top 0.305: U1.P$1 3.96,17.12 3.58,17.5 3.58,20.52 3.05,21.06 3.05,23.88 v3.45,24.28
  Bottom 0.305: v3.45,24.28 5.54,24.28 6.07,24.82 12.55,24.82 v13.34,25.6
RX  (via drill 0.3)
  Top 0.305: v13.84,14.91 13.96,15.02 U1.P$38
  Bottom 0.305: JP1.4 2.29,23.11 3.05,22.35 6.1,22.35 6.86,23.11 8.64,23.11 8.89,22.86 8.89,19.56 8.74,19.41 8.74,16.87 10.69,14.91 v13.84,14.91
SW
  Top 0.254: 11.35,27.89 D3.C | 11.35,27.64 11.46,27.74 | 12.53,27.74 U2.3
  Top 0.508: L5.1 11.02,28.22 11.35,27.89 | D3.C 11.35,27.64 | 11.46,27.74 12.53,27.74
  pour Top: 8.56,29.82 8.56,25.76 12.42,25.76 12.42,29.84 12.22,29.84 12.22,29.82
TX  (via drill 0.3)
  Top 0.305: v10.34,16.41 10.79,16.41 11.25,15.95 13.46,15.95 13.69,15.72 U1.P$39
  Bottom 0.305: JP1.3 2.67,25.27 2.67,23.93 3.28,23.37 5.84,23.37 6.58,24.03 8.76,24.03 9.47,23.32 9.47,17.25 v10.34,16.41
USB_DISC
  Top 0.152: 5.36,19.33 5.96,18.73 U1.P$54
  Top 0.254: 5.36,19.33 5.36,20.65 4.95,21.06 3.91,21.06 3.58,21.39 3.58,23.27 4.19,23.85 4.19,24.64 3.76,25.07 3.23,25.07 2.82,25.48 2.82,29.72 3.5,30.4 4.34,30.4 4.51,30.57 Q1.2
UVCC
  Top 0.254: X1.VBUS 11.46,31.24 | 14.39,33.92 D1.ANODE
  Top 0.381: 11.46,31.24 11.66,31.04
  Top 0.508: 11.66,31.04 12.24,31.04 13.06,31.85 13.06,32.59 14.39,33.92
VBAT  (via drill 0.3)
  Top 0.254: C15.1 16.03,5.75 C16.1 | U1.P$28 15.23,8.03 16.05,8.03
  Top 0.305: C16.1 16.74,7.14 16.51,7.37 16.51,7.62 16.06,8.02 | 16.06,8.02 U1.P$28 | v16.66,14.96 16.36,14.58 16.36,8.32 16.06,8.02
  Bottom 0.305: JP2.3 16.76,24.38 16.76,17.63 15.95,16.84 15.95,15.54 16.64,15.01 v16.66,14.96
VDD_3V3
  Top 0.305: C10.2 C11.1 11.56,19.62 U1.P$46 U1.P$47
VDD_WIFI
  Top 0.254: C13.1 C12.2 8.76,5.45 U1.P$19
  Top 0.305: U1.P$19 U1.P$20
VDDIO_WIFI
  Top 0.254: C9.2 C8.2 9.46,19.64
  Top 0.305: 9.46,19.64 U1.P$49
VIN  (via drill 0.51)
  Top 0.254: 17.44,34.94 D1.CATHODE 16.75,33.75 R4.2 | 16.15,29.03 16.15,29.2 16.43,29.2 C4.1
  Top 0.508: U2.4 U2.5 15.82,28.7 16.15,29.03 | C4.1 16.93,29.27 17.02,29.36 | v17.68,30.18 17.68,33.45 17.38,33.75 16.75,33.75
  Top 0.61: v17.68,30.18 17.68,30.02 17.02,29.36
  Bottom 0.813: JP1.1 6.96,31.75 7.67,31.04 16.82,31.04 v17.68,30.18
WKP  (via drill 0.3)
  Top 0.305: U1.P$27 14.36,7.66 14.17,7.87 14.17,8.03 v14.07,8.36 | v13.97,10.41 13.97,13.26 v13.77,13.46
  Bottom 0.305: v14.07,8.36 14.07,10.31 v13.97,10.41 | v13.77,13.46 9.4,13.46 5.59,17.27 5.59,19.81 3.81,21.59 JP1.5

### Text on the board
tPlace: VIN | 3V3 | GND | RST | TX | VBAT | RX | GND | WKP | D7 | DAC | D6 | A5 | D5 | A4 | D4 | A3 | D3 | A2 | D2 | A1 | D1 | A0 | D0
tDocu: NOTES: / / Layer stack up: / 1 - GTL - Top Copper / 2 - G2L - Inner Ground / 15 - G15L - Inner +3.3V / 16 - GBL - Bottom Copper